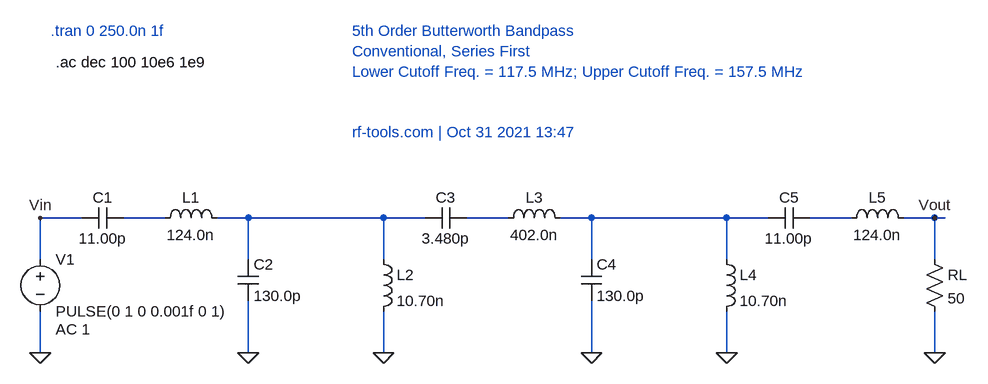
[diagram p0: schematic Butterworth-Bandpass-Series-First.asc]
Butterworth-Bandpass-Series-First.asc, the LTspice schematic file:
Version 4
SHEET 1 1428 400
WIRE 64 0 0 0
WIRE 192 0 128 0
WIRE 320 0 272 0
WIRE 528 0 320 0
WIRE 592 0 528 0
WIRE 720 0 656 0
WIRE 848 0 800 0
WIRE 1056 0 848 0
WIRE 1120 0 1056 0
WIRE 1248 0 1184 0
WIRE 1376 0 1328 0
WIRE 1392 0 1376 0
WIRE 0 64 0 0
WIRE 320 64 320 0
WIRE 528 64 528 0
WIRE 848 64 848 0
WIRE 1056 64 1056 0
WIRE 1376 64 1376 0
WIRE 0 208 0 144
WIRE 320 208 320 128
WIRE 528 208 528 144
WIRE 848 208 848 128
WIRE 1056 208 1056 144
WIRE 1376 208 1376 144
FLAG 0 0 Vin
FLAG 0 208 0
FLAG 320 208 0
FLAG 528 208 0
FLAG 848 208 0
FLAG 1056 208 0
FLAG 1376 208 0
FLAG 1376 0 Vout
SYMBOL voltage 0 48 R0
WINDOW 123 24 124 Left 2
WINDOW 39 39 77 Left 2
SYMATTR Value2 AC 1
SYMATTR InstName V1
SYMATTR Value PULSE(0 1 0 0.001f 0 1)
SYMBOL cap 64 16 R270
WINDOW 0 32 32 VTop 2
WINDOW 3 0 32 VBottom 2
SYMATTR InstName C1
SYMATTR Value 11.00p
SYMBOL ind 176 16 R270
WINDOW 0 32 56 VTop 2
WINDOW 3 5 56 VBottom 2
SYMATTR InstName L1
SYMATTR Value 124.0n
SYMBOL cap 304 64 R0
SYMATTR InstName C2
SYMATTR Value 130.0p
SYMBOL ind 512 48 R0
SYMATTR InstName L2
SYMATTR Value 10.70n
SYMBOL cap 592 16 R270
WINDOW 0 32 32 VTop 2
WINDOW 3 0 32 VBottom 2
SYMATTR InstName C3
SYMATTR Value 3.480p
SYMBOL ind 704 16 R270
WINDOW 0 32 56 VTop 2
WINDOW 3 5 56 VBottom 2
SYMATTR InstName L3
SYMATTR Value 402.0n
SYMBOL cap 832 64 R0
SYMATTR InstName C4
SYMATTR Value 130.0p
SYMBOL ind 1040 48 R0
SYMATTR InstName L4
SYMATTR Value 10.70n
SYMBOL cap 1120 16 R270
WINDOW 0 32 32 VTop 2
WINDOW 3 0 32 VBottom 2
SYMATTR InstName C5
SYMATTR Value 11.00p
SYMBOL ind 1232 16 R270
WINDOW 0 32 56 VTop 2
WINDOW 3 5 56 VBottom 2
SYMATTR InstName L5
SYMATTR Value 124.0n
SYMBOL res 1360 48 R0
SYMATTR InstName RL
SYMATTR Value 50
TEXT 16 -288 Left 2 ;.tran 0 250.0n 1f
TEXT 480 -288 Left 2 ;5th Order Butterworth Bandpass\nConventional, Series First\nLower Cutoff Freq. = 117.5 MHz; Upper Cutoff Freq. = 157.5 MHz\n\n\nrf-tools.com | Oct 31 2021 13:47
TEXT 24 -240 Left 2 !.ac dec 100 10e6 1e9

The netlist it stands for:
* Butterworth-Bandpass-Series-First.asc
V1 Vin 0 PULSE(0 1 0 0.001f 0 1) AC 1
C1 Vin N001 11.00p
L1 N001 N002 124.0n
C2 N002 0 130.0p
L2 N002 0 10.70n
C3 N002 N003 3.480p
L3 N003 N004 402.0n
C4 N004 0 130.0p
L4 N004 0 10.70n
C5 N004 N005 11.00p
L5 N005 Vout 124.0n
RL Vout 0 50
* .tran 0 250.0n 1f
* 5th Order Butterworth Bandpass
* Conventional, Series First
* Lower Cutoff Freq. = 117.5 MHz; Upper Cutoff Freq. = 157.5 MHz
* rf-tools.com | Oct 31 2021 13:47
.ac dec 100 10e6 1e9
.backanno
.end